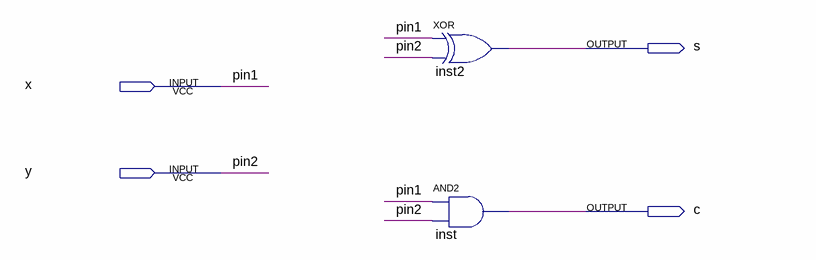
[diagram p0: schematic sheet]
// Quartus schematic halfAdder.bdf as structural Verilog: 2 symbols, 4 pins
module halfAdder (
  input  x,
  input  y,
  output s,
  output c
);

  xor inst2 (s, x, y);
  and inst (c, x, y);

  // Other names for the same wires on the sheet: pin1 = x; pin2 = y
endmodule
